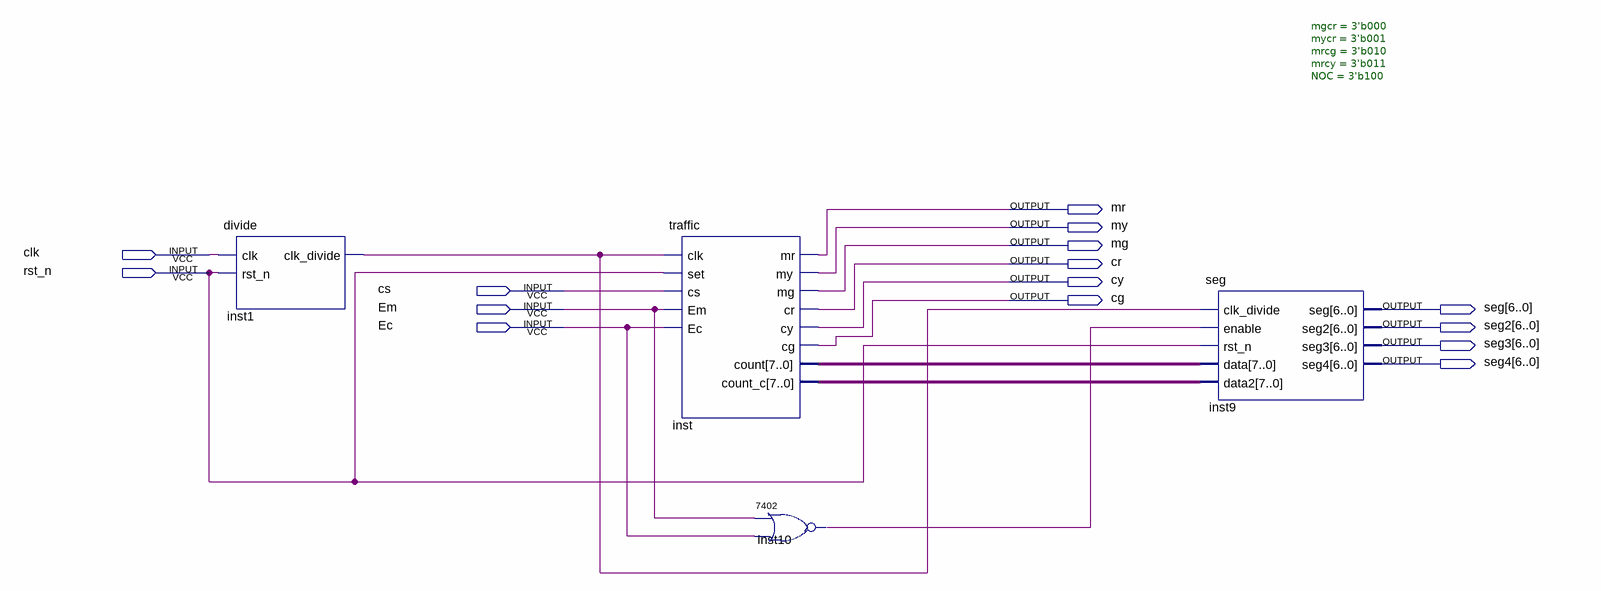
[diagram p0: schematic sheet]
// Quartus schematic Block1.bdf as structural Verilog: 4 symbols, 15 pins
module Block1 (
  input  clk,
  input  rst_n,
  input  cs,
  input  Em,
  input  Ec,
  output mr,
  output my,
  output mg,
  output cr,
  output cy,
  output cg,
  output [6:0] seg,
  output [6:0] seg2,
  output [6:0] seg3,
  output [6:0] seg4
);

  wire inst1_clk_divide, inst10_1;
  wire [7:0] inst_count, inst_count_c;

  divide inst1 (.clk(clk), .rst_n(rst_n), .clk_divide(inst1_clk_divide));
  traffic #(.mgcr(3'b000), .mycr(3'b001), .mrcg(3'b010), .mrcy(3'b011), .NOC(3'b100)) inst (
    .clk(inst1_clk_divide), .set(rst_n), .cs(cs), .Em(Em), .Ec(Ec), .mr(mr), .my(my), .mg(mg), .cr(cr),
    .cy(cy), .cg(cg), .count(inst_count), .count_c(inst_count_c));
  \7402  inst10 (.\2 (Em), .\3 (Ec), .\1 (inst10_1));
  seg inst9 (
    .clk_divide(inst1_clk_divide), .enable(inst10_1), .rst_n(rst_n), .data(inst_count), .data2(inst_count_c),
    .seg(seg), .seg2(seg2), .seg3(seg3), .seg4(seg4));
endmodule
